# Altium schematic sheet Schematic_page2.SchDoc
size 420 x 297 mm; Address1: Address1; Address2: Address2; Address3: Address3; Address4: Address4; DocumentNumber: АБВГ.123456.001 Э3; SheetNumber: 1; Scale: 1:1; DocumentType: Схема электрическая принципиальная; FirstReferrence: АБВГ.123456.001
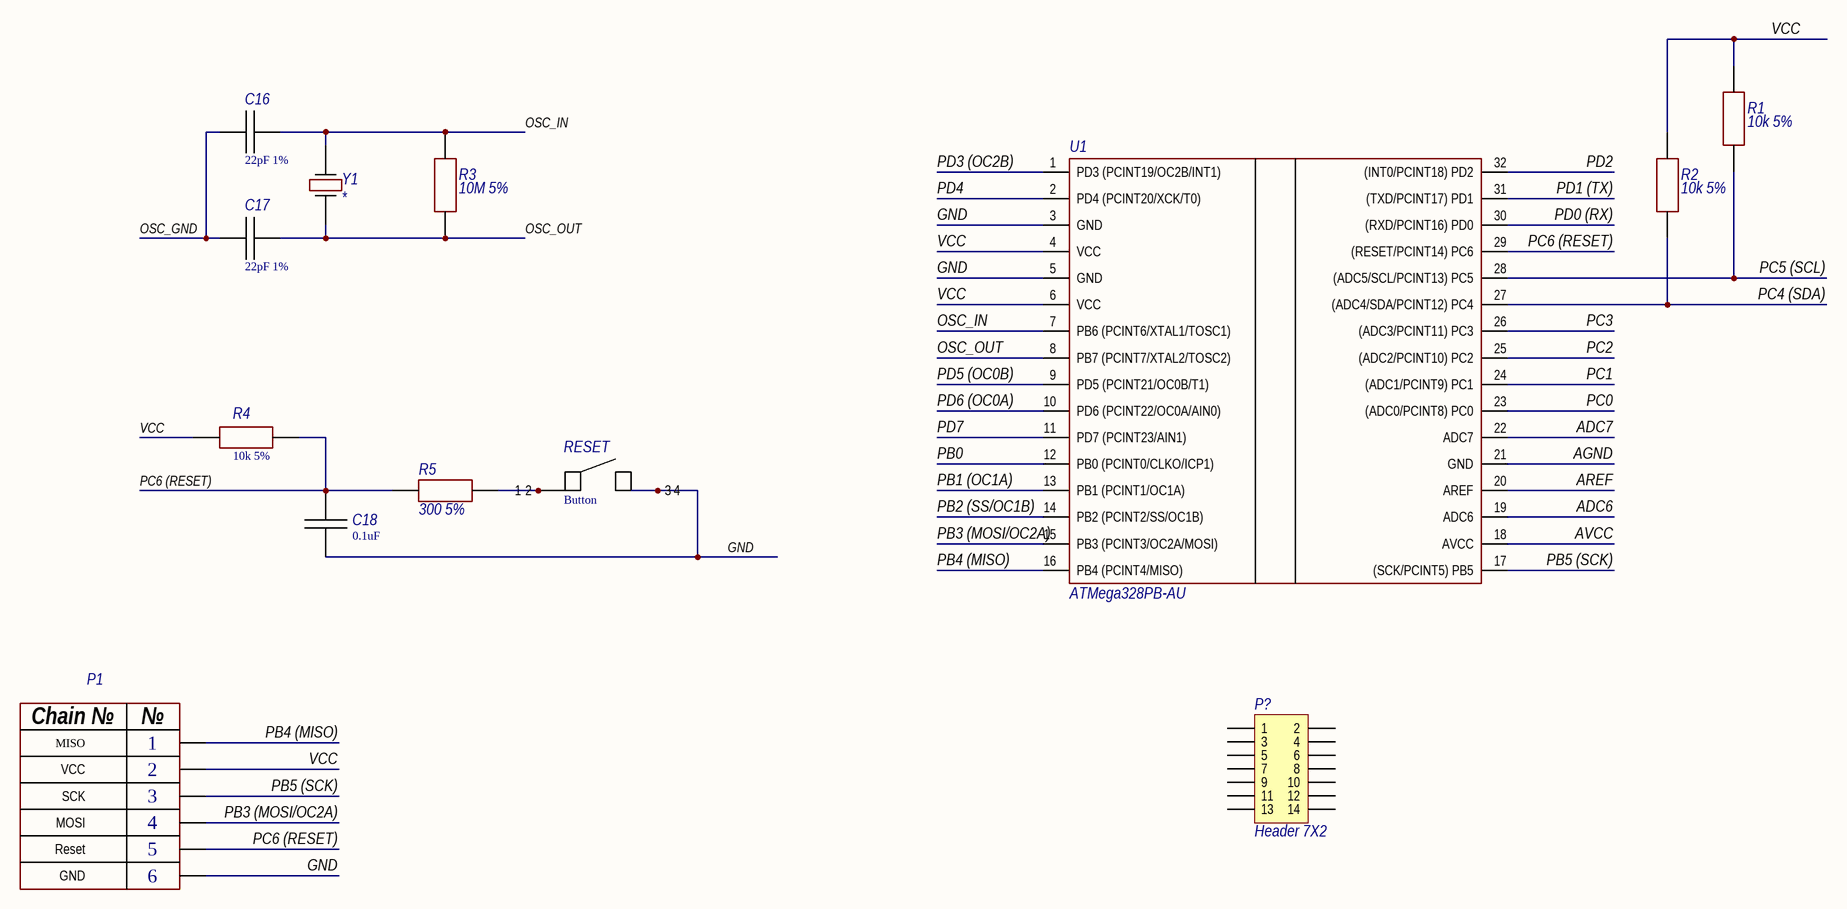
[diagram p0: Schematic_page2.SchDoc]

## Parts
C16  22pF 1%  [C0603]
C17  22pF 1%  [C0603]
C18  0.1uF  [C0603]
P1  ICSP  [2x3 Male Header Through Hole Pitch 2.54 mm]  (value not drawn)
P?  Header 7X2  [HDR2X7]
R1  10k 5%  [R0603]
R2  10k 5%  [R0603]
R3  10M 5%  [R0603]
R4  10k 5%  [R0603]
R5  300 5%  [R0603]
RESET  Button  [KMR221GLFS]
U1  ATMega328PB-AU  [TQFP-32 (7x7)]
Y1  *  [HC-49S]

## Nets
ADC6: U1.19(ADC6)
ADC7: U1.22(ADC7)
AGND: U1.21(GND)
AREF: U1.20(AREF)
AVCC: U1.18(AVCC)
GND: C18.2 P1.6(GND) RESET.3 RESET.4 U1.3(GND) U1.5(GND)
OSC_GND: C16.1 C17.2
OSC_IN: C16.2 R3.2 U1.7(PB6_(PCINT6/XTAL1/TOSC1)) Y1.2
OSC_OUT: C17.1 R3.1 U1.8(PB7_(PCINT7/XTAL2/TOSC2)) Y1.1
PB0: U1.12(PB0_(PCINT0/CLKO/ICP1))
PB1 (OC1A): U1.13(PB1_(PCINT1/OC1A))
PB2 (SS/OC1B): U1.14(PB2_(PCINT2/SS/OC1B))
PB3 (MOSI/OC2A): P1.4(MOSI) U1.15(PB3_(PCINT3/OC2A/MOSI))
PB4 (MISO): P1.1(MISO) U1.16(PB4_(PCINT4/MISO))
PB5 (SCK): P1.3(SCK) U1.17((SCK/PCINT5)_PB5)
PC0: U1.23((ADC0/PCINT8)_PC0)
PC1: U1.24((ADC1/PCINT9)_PC1)
PC2: U1.25((ADC2/PCINT10)_PC2)
PC3: U1.26((ADC3/PCINT11)_PC3)
PC4 (SDA): R2.1 U1.27((ADC4/SDA/PCINT12)_PC4)
PC5 (SCL): R1.1 U1.28((ADC5/SCL/PCINT13)_PC5)
PC6 (RESET): C18.1 P1.5(Reset) R4.2 R5.1 U1.29((RESET/PCINT14)_PC6)
PD0 (RX): U1.30((RXD/PCINT16)_PD0)
PD1 (TX): U1.31((TXD/PCINT17)_PD1)
PD2: U1.32((INT0/PCINT18)_PD2)
PD3 (OC2B): U1.1(PD3_(PCINT19/OC2B/INT1))
PD4: U1.2(PD4_(PCINT20/XCK/T0))
PD5 (OC0B): U1.9(PD5_(PCINT21/OC0B/T1))
PD6 (OC0A): U1.10(PD6_(PCINT22/OC0A/AIN0))
PD7: U1.11(PD7_(PCINT23/AIN1))
VCC: P1.2(VCC) R1.2 R2.2 R4.1 U1.4(VCC) U1.6(VCC)
NetR5_2: R5.2 RESET.1 RESET.2

Not connected (* = marked no-connect by the designer): P? 1 2 3 4 5 6 7 8 9 10 11 12 13 14

## Notes on the sheet
- Перв. примен.
- Справ. №
- Подп. и дата
- Инв. № дубл.
- Взам. инв. №
- Разраб.
- Изм.
- Лист
- № докум.
- Подп.
- Дата
- Лит.
- Масса
- Масштаб
- Пров.
- Т.контр.
- Листов
- Инв. № подл.
- Утв.
- Н.контр.
- 2.106-A3
- Копировал
- Формат А3
- (in symbol ICSP) Chain №; №

## Library data of the parts
C16-C18 = Capasitor: Case: *; Manufacturer: *; HelpURL: *; Model: *
  C16 C17: Value: 22pF 1%
  C18: Value: 0.1uF
P? = Header 7X2: Header, 7-Pin, Dual row; LatestRevisionDate: 17-Jul-2002; LatestRevisionNote: Re-released for DXP Platform.; Publisher: Altium Limited
R1-R5 = Resistor: Model: *; HelpURL: *; Case: *; Manufacturer: *
  R1 R2 R4: Value: 10k 5%
  R3: Value: 10M 5%
  R5: Value: 300 5%
RESET = Button: SWITCH TACTILE SPST-NO 0.05A 32V; Manufacturer: C&K; HelpURL: https://www.digikey.com/product-detail/en/c-k/KMR221GLFS/401-1427-1-ND/550466; Model: KMR221GLFS; Case: KMR221GLFS
U1 = ATMega328P: AVR AVR® ATmega Microcontroller IC 8-Bit 20MHz 32KB (16K x 16) FLASH 32-TQFP (7x7); Manufacturer: Microchip Technology; Model: ATMega328PB-AU; HelpURL: https://www.digikey.com/product-detail/en/microchip-technology/ATMEGA328PB-AU/ATMEGA328PB-AU-ND/5638812; Case: TQFP-32
Y1 = Crystal: Value: *; Model: *; HelpURL: *; Case: *
P1 = ICSP: Case: *; Model: *; HelpURL: *